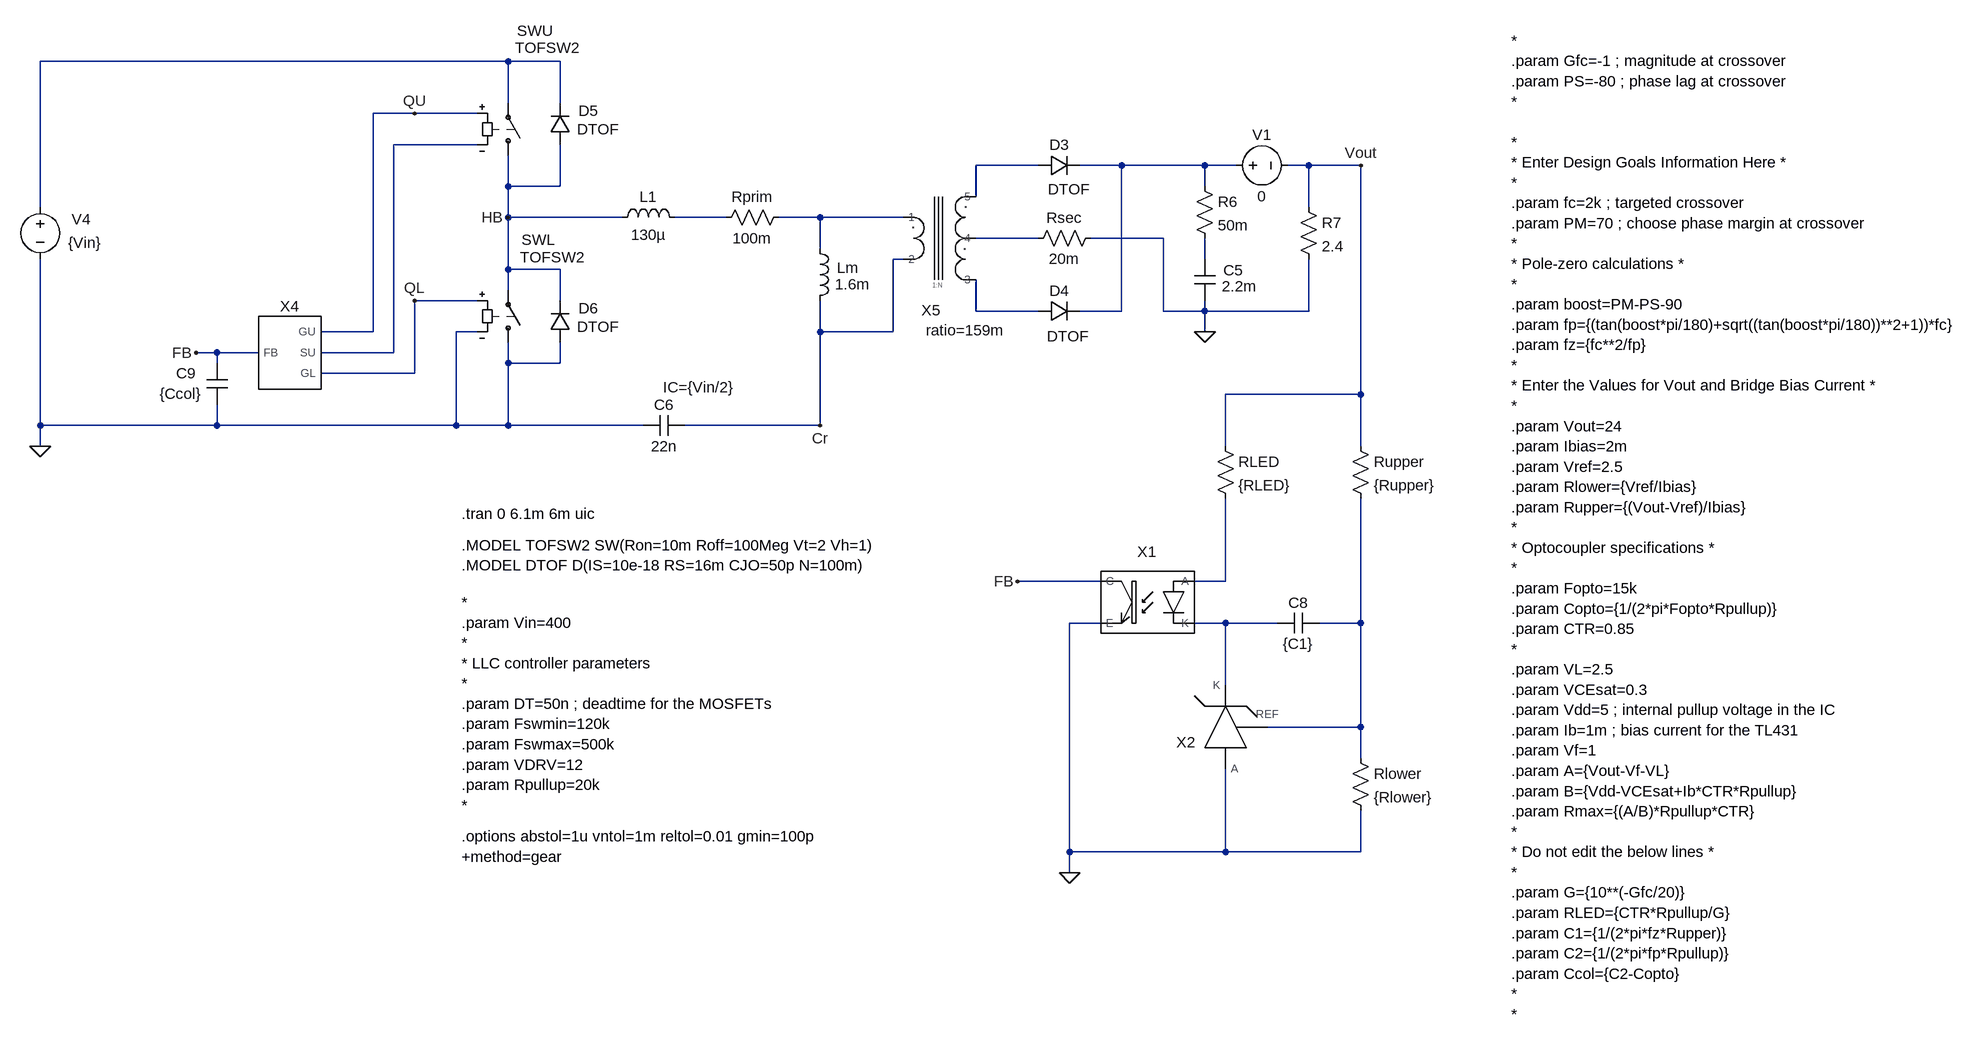
[diagram p0: schematic LLC VM - cbc.asc]
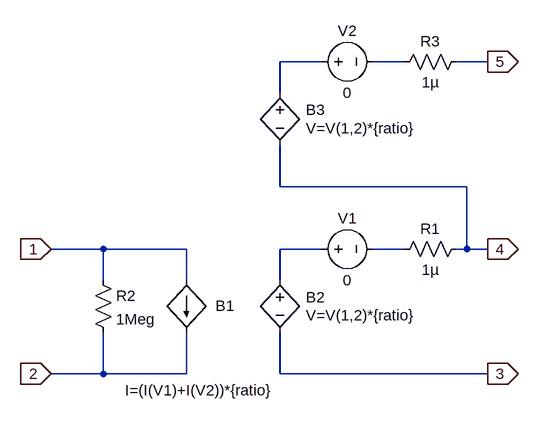
[diagram p1: sub-circuit xfmr_ctap.asc]
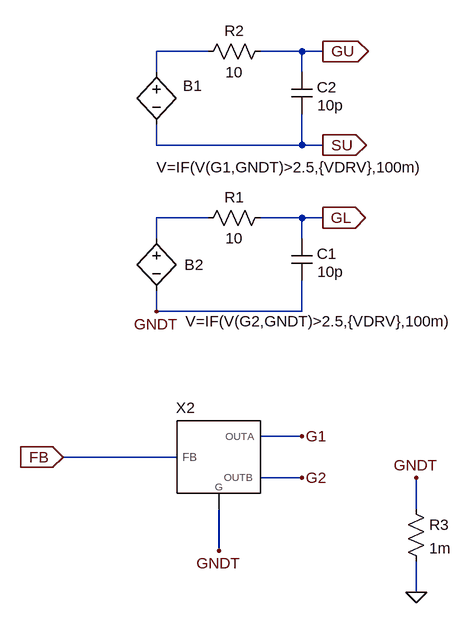
[diagram p2: sub-circuit generic_llc_vm.asc]
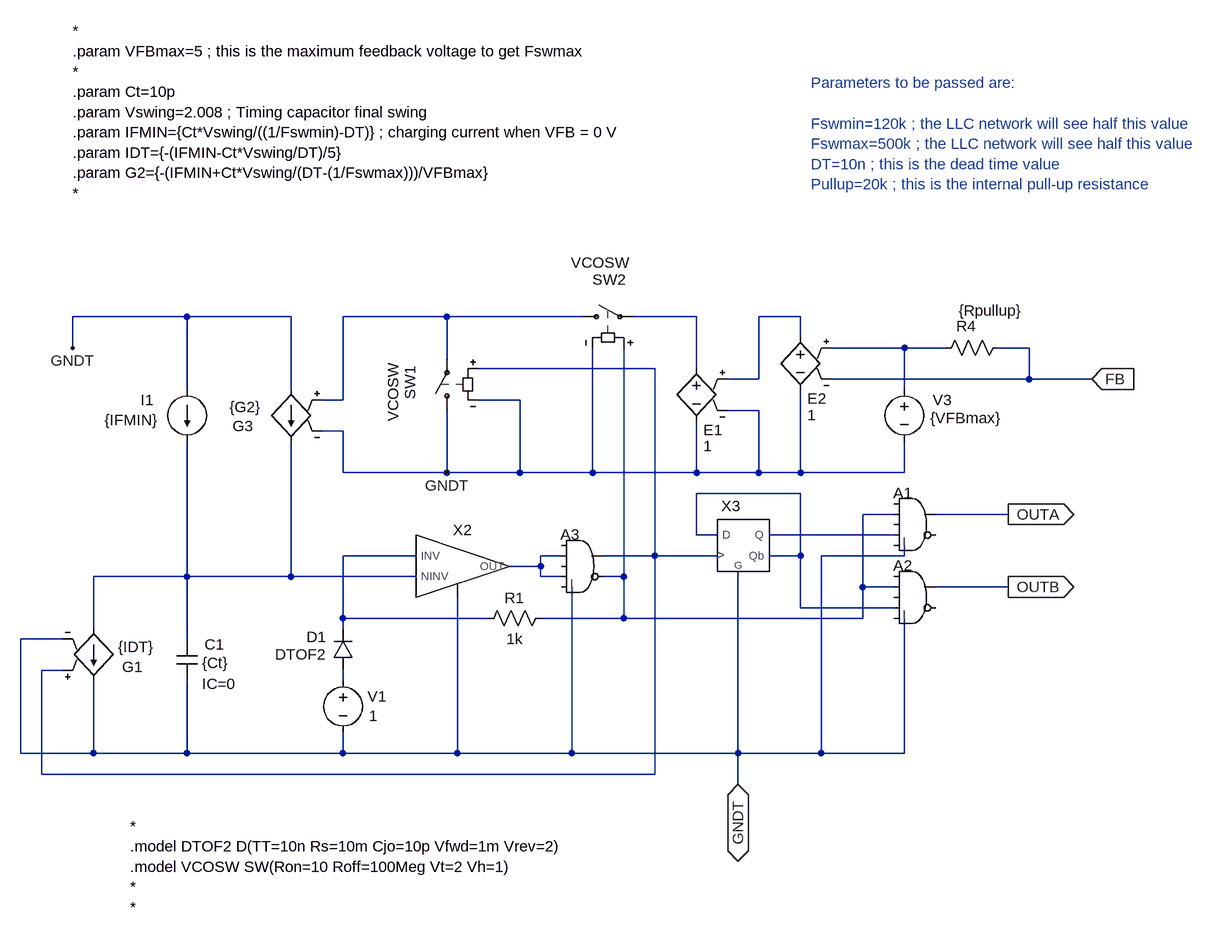
[diagram p3: sub-circuit vco_pulldown_subckt.asc]
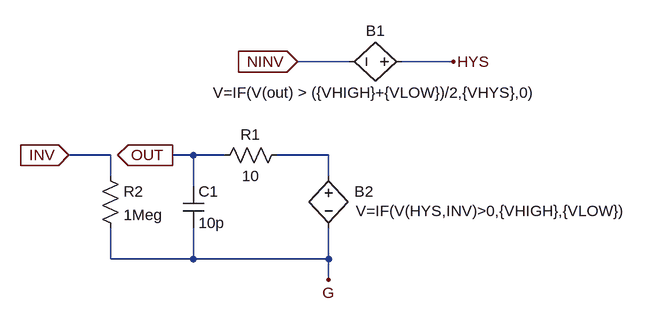
[diagram p4: sub-circuit comptof_g.asc]
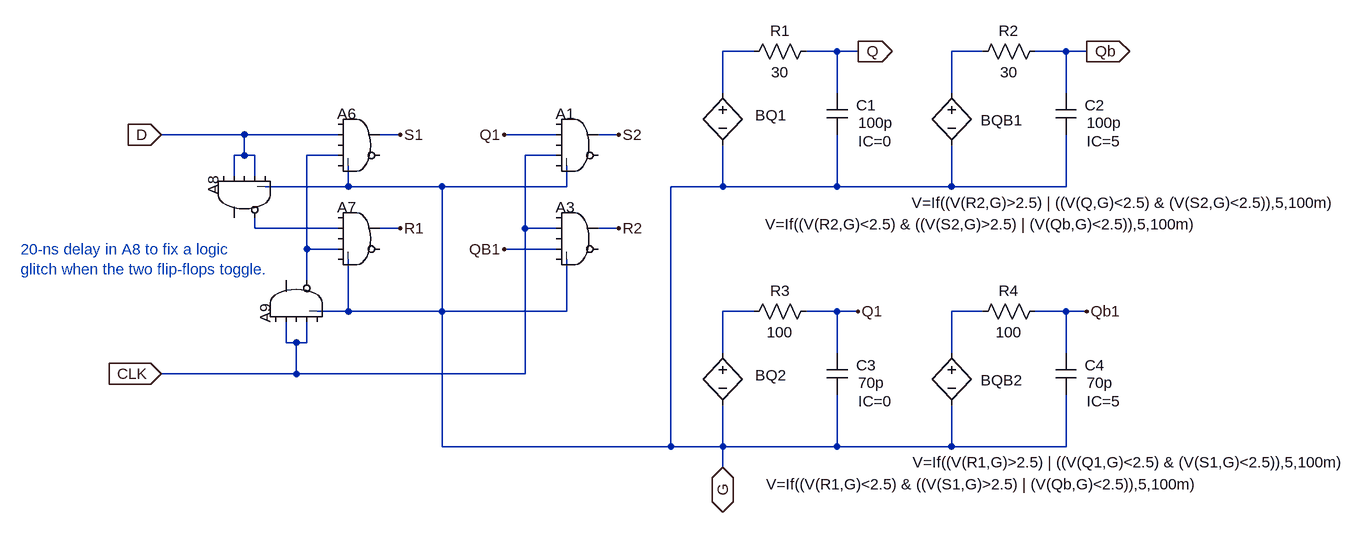
[diagram p5: sub-circuit d_flipflop_g.asc]
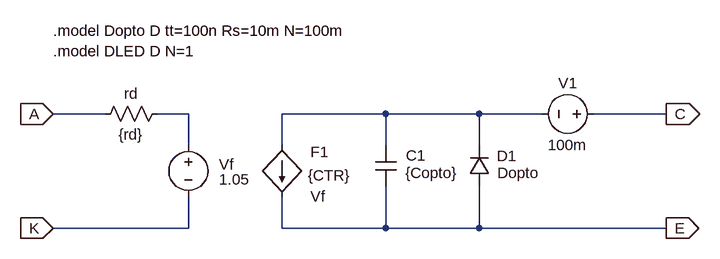
[diagram p6: sub-circuit optotof.asc]
LLC VM - cbc.asc, the LTspice schematic file:
Version 4.1
SHEET 1 3260 680
WIRE -1024 -800 -1744 -800
WIRE -944 -800 -1024 -800
WIRE -1024 -736 -1024 -800
WIRE -944 -736 -944 -800
WIRE -1168 -720 -1232 -720
WIRE -1072 -720 -1168 -720
WIRE -1072 -672 -1200 -672
WIRE -208 -640 -304 -640
WIRE -80 -640 -144 -640
WIRE 48 -640 -80 -640
WIRE 96 -640 48 -640
WIRE 208 -640 176 -640
WIRE 288 -640 208 -640
WIRE -1024 -608 -1024 -656
WIRE -944 -608 -944 -672
WIRE -944 -608 -1024 -608
WIRE 48 -608 48 -640
WIRE -304 -592 -304 -640
WIRE -1744 -576 -1744 -800
WIRE 208 -576 208 -640
WIRE -1024 -560 -1024 -608
WIRE -848 -560 -1024 -560
WIRE -688 -560 -768 -560
WIRE -544 -560 -608 -560
WIRE -416 -560 -544 -560
WIRE -208 -528 -304 -528
WIRE -16 -528 -128 -528
WIRE -544 -512 -544 -560
WIRE -416 -496 -432 -496
WIRE 48 -496 48 -528
WIRE -1024 -480 -1024 -560
WIRE -944 -480 -1024 -480
WIRE -1024 -448 -1024 -480
WIRE -1072 -432 -1168 -432
WIRE -944 -432 -944 -480
WIRE -304 -416 -304 -464
WIRE -208 -416 -304 -416
WIRE -80 -416 -80 -640
WIRE -80 -416 -144 -416
WIRE -16 -416 -16 -528
WIRE 48 -416 48 -432
WIRE 48 -416 -16 -416
WIRE 208 -416 208 -496
WIRE 208 -416 48 -416
WIRE -1232 -384 -1232 -720
WIRE -1232 -384 -1312 -384
WIRE -1072 -384 -1104 -384
WIRE -544 -384 -544 -432
WIRE -432 -384 -432 -496
WIRE -432 -384 -544 -384
WIRE 48 -384 48 -416
WIRE -1472 -352 -1504 -352
WIRE -1408 -352 -1472 -352
WIRE -1200 -352 -1200 -672
WIRE -1200 -352 -1312 -352
WIRE -1472 -336 -1472 -352
WIRE -1024 -336 -1024 -368
WIRE -944 -336 -944 -368
WIRE -944 -336 -1024 -336
WIRE -1168 -320 -1168 -432
WIRE -1168 -320 -1312 -320
WIRE 288 -288 288 -640
WIRE 288 -288 80 -288
WIRE -1744 -240 -1744 -496
WIRE -1472 -240 -1472 -272
WIRE -1472 -240 -1744 -240
WIRE -1104 -240 -1104 -384
WIRE -1104 -240 -1472 -240
WIRE -1024 -240 -1024 -336
WIRE -1024 -240 -1104 -240
WIRE -816 -240 -1024 -240
WIRE -544 -240 -544 -384
WIRE -544 -240 -752 -240
WIRE -1744 -208 -1744 -240
WIRE 80 -208 80 -288
WIRE 288 -208 288 -288
WIRE -112 0 -240 0
WIRE 80 0 80 -128
WIRE 80 0 32 0
WIRE -112 64 -160 64
WIRE 80 64 32 64
WIRE 160 64 80 64
WIRE 288 64 288 -128
WIRE 288 64 224 64
WIRE 80 160 80 64
WIRE 288 224 288 64
WIRE 288 224 144 224
WIRE 288 272 288 224
WIRE -160 416 -160 64
WIRE 80 416 80 288
WIRE 80 416 -160 416
WIRE 288 416 288 352
WIRE 288 416 80 416
WIRE -160 448 -160 416
FLAG -1504 -352 FB
FLAG 48 -384 0
FLAG 288 -640 Vout
FLAG -1024 -560 HB
FLAG -1168 -720 QU
FLAG -1168 -432 QL
FLAG -544 -240 Cr
FLAG -1744 -208 0
FLAG -240 0 FB
FLAG -160 448 0
SYMBOL diode -208 -624 R270
WINDOW 0 32 32 VTop 2
WINDOW 3 -5 48 VBottom 2
SYMATTR InstName D3
SYMATTR Value DTOF
SYMBOL diode -208 -400 R270
WINDOW 0 32 32 VTop 2
WINDOW 3 -7 46 VBottom 2
SYMATTR InstName D4
SYMATTR Value DTOF
SYMBOL res 32 -624 R0
SYMATTR InstName R6
SYMATTR Value 50m
SYMBOL cap 32 -496 R0
WINDOW 0 45 17 Left 2
WINDOW 3 42 42 Left 2
SYMATTR InstName C5
SYMATTR Value 2.2m
SYMBOL res 192 -592 R0
SYMATTR InstName R7
SYMATTR Value 2.4
SYMBOL res -112 -544 R90
WINDOW 0 0 56 VBottom 2
WINDOW 3 32 56 VTop 2
SYMATTR InstName Rsec
SYMATTR Value 20m
SYMBOL ind -560 -528 R0
WINDOW 0 42 45 Left 2
WINDOW 3 39 71 Left 2
SYMATTR InstName Lm
SYMATTR Value 1.6m
SYMBOL cap -752 -256 R90
WINDOW 0 0 32 VBottom 2
WINDOW 3 32 32 VTop 2
WINDOW 123 -27 -21 VBottom 2
SYMATTR InstName C6
SYMATTR Value 22n
SYMATTR Value2 IC={Vin/2}
SYMBOL res -592 -576 R90
WINDOW 0 0 56 VBottom 2
WINDOW 3 32 56 VTop 2
SYMATTR InstName Rprim
SYMATTR Value 100m
SYMBOL ind -864 -544 R270
WINDOW 0 32 56 VTop 2
WINDOW 3 5 56 VBottom 2
SYMATTR InstName L1
SYMATTR Value 130µ
SYMBOL sw -1024 -640 M180
WINDOW 3 11 181 Left 2
WINDOW 0 14 207 Left 2
SYMATTR Value TOFSW2
SYMATTR InstName SWU
SYMBOL sw -1024 -352 M180
WINDOW 3 18 147 Left 2
WINDOW 0 21 174 Left 2
SYMATTR Value TOFSW2
SYMATTR InstName SWL
SYMBOL voltage -1744 -592 R0
WINDOW 0 48 35 Left 2
WINDOW 3 43 71 Left 2
SYMATTR InstName V4
SYMATTR Value {Vin}
SYMBOL diode -928 -672 R180
WINDOW 0 -43 52 Left 2
WINDOW 3 -76 24 Left 2
SYMATTR InstName D5
SYMATTR Value DTOF
SYMBOL diode -928 -368 R180
WINDOW 0 -43 52 Left 2
WINDOW 3 -76 24 Left 2
SYMATTR InstName D6
SYMATTR Value DTOF
SYMBOL XFMR_CTap -352 -544 R0
WINDOW 0 -21 142 Bottom 2
WINDOW 39 32 173 Bottom 2
SYMATTR InstName X5
SYMATTR SpiceLine ratio=159m
SYMBOL res 272 256 R0
SYMATTR InstName Rlower
SYMATTR Value {Rlower}
SYMBOL res 272 -224 R0
SYMATTR InstName Rupper
SYMATTR Value {Rupper}
SYMBOL res 64 -224 R0
SYMATTR InstName RLED
SYMATTR Value {RLED}
SYMBOL cap 224 48 R90
WINDOW 0 0 32 VBottom 2
WINDOW 3 32 32 VTop 2
SYMATTR InstName C8
SYMATTR Value {C1}
SYMBOL cap -1456 -336 M0
WINDOW 0 48 16 Left 2
WINDOW 3 40 47 Left 2
SYMATTR InstName C9
SYMATTR Value {Ccol}
SYMBOL voltage 80 -640 R270
WINDOW 0 32 56 VTop 2
WINDOW 3 -32 56 VBottom 2
SYMATTR InstName V1
SYMATTR Value 0
SYMBOL TOF\\Subcircuits\\Generic_LLC_VM -1360 -352 R0
SYMATTR InstName X4
SYMATTR SpiceLine Fswmin={Fswmin} Fswmax={Fswmax} DT={DT} Rpullup={Rpullup} VDRV={VDRV}
SYMBOL TOF\\Subcircuits\\optoTOF -80 32 M0
SYMATTR InstName X1
SYMATTR SpiceLine rd=100 CTR={CTR} Copto={Copto}
SYMBOL TOF\\Subcircuits\\TL431TOF 64 176 R0
WINDOW 0 -45 87 Bottom 2
SYMATTR InstName X2
TEXT -1096 -104 Left 2 !.tran 0 6.1m 6m uic
TEXT -1096 -56 Left 2 !.MODEL TOFSW2 SW(Ron=10m Roff=100Meg Vt=2 Vh=1)\n.MODEL DTOF D(IS=10e-18 RS=16m CJO=50p N=100m)
TEXT -1096 32 Left 2 !*\n.param Vin=400\n*\n* LLC controller parameters\n*\n.param DT=50n ; deadtime for the MOSFETs\n.param Fswmin=120k\n.param Fswmax=500k\n.param VDRV=12\n.param Rpullup=20k\n*
TEXT -1096 392 Left 2 !.options abstol=1u vntol=1m reltol=0.01 gmin=100p\n+method=gear
TEXT 520 -832 Left 2 !*\n.param Gfc=-1 ; magnitude at crossover\n.param PS=-80 ; phase lag at crossover\n*\n \n*\n* Enter Design Goals Information Here *\n*\n.param fc=2k ; targeted crossover\n.param PM=70 ; choose phase margin at crossover\n*\n* Pole-zero calculations *\n*\n.param boost=PM-PS-90\n.param fp={(tan(boost*pi/180)+sqrt((tan(boost*pi/180))**2+1))*fc}\n.param fz={fc**2/fp}\n*\n* Enter the Values for Vout and Bridge Bias Current *\n*\n.param Vout=24\n.param Ibias=2m\n.param Vref=2.5\n.param Rlower={Vref/Ibias}\n.param Rupper={(Vout-Vref)/Ibias}\n*\n* Optocoupler specifications *\n*\n.param Fopto=15k\n.param Copto={1/(2*pi*Fopto*Rpullup)}\n.param CTR=0.85\n*\n.param VL=2.5\n.param VCEsat=0.3\n.param Vdd=5 ; internal pullup voltage in the IC\n.param Ib=1m ; bias current for the TL431\n.param Vf=1\n.param A={Vout-Vf-VL}\n.param B={Vdd-VCEsat+Ib*CTR*Rpullup}\n.param Rmax={(A/B)*Rpullup*CTR}\n*\n* Do not edit the below lines *\n*\n.param G={10**(-Gfc/20)}\n.param RLED={CTR*Rpullup/G}\n.param C1={1/(2*pi*fz*Rupper)}\n.param C2={1/(2*pi*fp*Rpullup)}\n.param Ccol={C2-Copto}\n*\n*

xfmr_ctap.asc, the sub-circuit schematic file:
Version 4
SHEET 1 880 680
WIRE 368 -192 304 -192
WIRE 496 -192 448 -192
WIRE 624 -192 576 -192
WIRE 304 -144 304 -192
WIRE 304 0 304 -64
WIRE 592 0 304 0
WIRE 32 96 -48 96
WIRE 160 96 32 96
WIRE 368 96 304 96
WIRE 496 96 448 96
WIRE 592 96 592 0
WIRE 592 96 576 96
WIRE 624 96 592 96
WIRE 32 144 32 96
WIRE 160 144 160 96
WIRE 304 144 304 96
WIRE 32 288 32 224
WIRE 32 288 -48 288
WIRE 160 288 160 224
WIRE 160 288 32 288
WIRE 304 288 304 224
WIRE 624 288 304 288
FLAG 624 96 4
IOPIN 624 96 Out
FLAG 624 288 3
IOPIN 624 288 Out
FLAG -48 96 1
IOPIN -48 96 In
FLAG -48 288 2
IOPIN -48 288 In
FLAG 624 -192 5
IOPIN 624 -192 Out
SYMBOL bi 160 144 R0
WINDOW 0 45 39 Left 2
WINDOW 3 -94 169 Left 2
SYMATTR InstName B1
SYMATTR Value I=(I(V1)+I(V2))*{ratio}
SYMBOL bv 304 128 R0
WINDOW 0 40 42 Left 2
WINDOW 3 40 70 Left 2
SYMATTR InstName B2
SYMATTR Value V=V(1,2)*{ratio}
SYMBOL voltage 352 96 R270
WINDOW 0 32 56 VTop 2
WINDOW 3 -32 56 VBottom 2
WINDOW 123 0 0 Left 0
WINDOW 39 0 0 Left 0
SYMATTR InstName V1
SYMATTR Value 0
SYMBOL res 592 80 R90
WINDOW 0 0 56 VBottom 2
WINDOW 3 32 56 VTop 2
SYMATTR InstName R1
SYMATTR Value 1µ
SYMBOL res 16 128 R0
SYMATTR InstName R2
SYMATTR Value 1Meg
SYMBOL bv 304 -160 R0
WINDOW 0 40 42 Left 2
WINDOW 3 40 70 Left 2
SYMATTR InstName B3
SYMATTR Value V=V(1,2)*{ratio}
SYMBOL voltage 352 -192 R270
WINDOW 0 32 56 VTop 2
WINDOW 3 -32 56 VBottom 2
WINDOW 123 0 0 Left 0
WINDOW 39 0 0 Left 0
SYMATTR InstName V2
SYMATTR Value 0
SYMBOL res 592 -208 R90
WINDOW 0 0 56 VBottom 2
WINDOW 3 32 56 VTop 2
SYMATTR InstName R3
SYMATTR Value 1µ

generic_llc_vm.asc, the sub-circuit schematic file:
Version 4.1
SHEET 1 880 680
WIRE 112 -448 32 -448
WIRE 256 -448 192 -448
WIRE 288 -448 256 -448
WIRE 32 -416 32 -448
WIRE 256 -416 256 -448
WIRE 32 -304 32 -336
WIRE 256 -304 256 -352
WIRE 256 -304 32 -304
WIRE 288 -304 256 -304
WIRE 112 -192 32 -192
WIRE 256 -192 192 -192
WIRE 288 -192 256 -192
WIRE 32 -160 32 -192
WIRE 256 -160 256 -192
WIRE 32 -48 32 -80
WIRE 256 -48 256 -96
WIRE 256 -48 32 -48
WIRE 256 144 192 144
WIRE 64 176 -112 176
WIRE 256 208 192 208
WIRE 432 256 432 208
WIRE 128 320 128 256
WIRE 432 384 432 336
FLAG -112 176 FB
IOPIN -112 176 In
FLAG 128 320 GNDT
FLAG 32 -48 GNDT
FLAG 288 -192 GL
IOPIN 288 -192 Out
FLAG 288 -448 GU
IOPIN 288 -448 Out
FLAG 288 -304 SU
IOPIN 288 -304 Out
FLAG 256 144 G1
FLAG 256 208 G2
FLAG 432 384 0
FLAG 432 208 GNDT
SYMBOL bv 32 -432 R0
WINDOW 0 41 37 Left 2
WINDOW 3 0 162 Left 2
SYMATTR InstName B1
SYMATTR Value V=IF(V(G1,GNDT)>2.5,{VDRV},100m)
SYMBOL bv 32 -176 R0
WINDOW 0 43 56 Left 2
WINDOW 3 45 143 Left 2
SYMATTR InstName B2
SYMATTR Value V=IF(V(G2,GNDT)>2.5,{VDRV},100m)
SYMBOL res 208 -208 R90
WINDOW 0 0 56 VBottom 2
WINDOW 3 32 56 VTop 2
SYMATTR InstName R1
SYMATTR Value 10
SYMBOL cap 240 -160 R0
WINDOW 0 39 23 Left 2
WINDOW 3 40 51 Left 2
SYMATTR InstName C1
SYMATTR Value 10p
SYMBOL res 208 -464 R90
WINDOW 0 0 56 VBottom 2
WINDOW 3 32 56 VTop 2
SYMATTR InstName R2
SYMATTR Value 10
SYMBOL cap 240 -416 R0
WINDOW 0 39 23 Left 2
WINDOW 3 40 51 Left 2
SYMATTR InstName C2
SYMATTR Value 10p
SYMBOL res 416 240 R0
SYMATTR InstName R3
SYMATTR Value 1m
SYMBOL TOF\\Subcircuits\\VCO_pulldown_subckt 128 176 R0
WINDOW 0 -51 -60 Bottom 2
SYMATTR InstName X2
SYMATTR SpiceLine Fswmin={Fswmin} Fswmax={Fswmax} Rpullup={Rpullup} DT={DT}

vco_pulldown_subckt.asc, the sub-circuit schematic file:
Version 4.1
SHEET 1 1284 752
WIRE -656 -160 -832 -160
WIRE -496 -160 -656 -160
WIRE -256 -160 -416 -160
WIRE -48 -160 -256 -160
WIRE 128 -160 32 -160
WIRE 288 -160 224 -160
WIRE 288 -128 288 -160
WIRE -832 -112 -832 -160
WIRE 448 -112 336 -112
WIRE 512 -112 448 -112
WIRE 640 -112 592 -112
WIRE -256 -96 -256 -160
WIRE 64 -80 -208 -80
WIRE 128 -80 128 -160
WIRE 224 -64 224 -160
WIRE 224 -64 176 -64
WIRE 640 -64 640 -112
WIRE 640 -64 336 -64
WIRE 736 -64 640 -64
WIRE -656 -48 -656 -160
WIRE -496 -48 -496 -160
WIRE 448 -48 448 -112
WIRE -416 -32 -416 -160
WIRE -416 -32 -448 -32
WIRE -144 -32 -208 -32
WIRE 224 -16 176 -16
WIRE -416 16 -448 16
WIRE -416 80 -416 16
WIRE -256 80 -256 -16
WIRE -256 80 -416 80
WIRE -144 80 -144 -32
WIRE -144 80 -256 80
WIRE -32 80 -32 -112
WIRE -32 80 -144 80
WIRE 128 80 128 0
WIRE 128 80 -32 80
WIRE 224 80 224 -16
WIRE 224 80 128 80
WIRE 288 80 288 -48
WIRE 288 80 224 80
WIRE 448 80 448 32
WIRE 448 80 288 80
WIRE 288 112 128 112
WIRE 432 144 384 144
WIRE 608 144 496 144
WIRE 128 176 128 112
WIRE 160 176 128 176
WIRE 432 176 240 176
WIRE -304 208 -416 208
WIRE -80 208 -112 208
WIRE 64 208 64 -80
WIRE 64 208 -16 208
WIRE 160 208 64 208
WIRE 288 208 288 112
WIRE 288 208 240 208
WIRE 448 208 448 192
WIRE 448 208 320 208
WIRE -112 224 -112 208
WIRE -112 224 -160 224
WIRE -656 240 -656 32
WIRE -656 240 -800 240
WIRE -496 240 -496 32
WIRE -496 240 -656 240
WIRE -304 240 -496 240
WIRE -112 240 -112 224
WIRE -80 240 -112 240
WIRE 16 240 16 -112
WIRE 16 240 -16 240
WIRE 384 256 384 144
WIRE 432 256 384 256
WIRE 608 256 496 256
WIRE 288 288 288 208
WIRE 432 288 288 288
WIRE -416 304 -416 208
WIRE -192 304 -416 304
WIRE 16 304 16 240
WIRE 16 304 -112 304
WIRE 384 304 384 256
WIRE 384 304 16 304
WIRE -800 320 -800 240
WIRE -416 320 -416 304
WIRE -848 336 -912 336
WIRE -656 336 -656 240
WIRE -848 384 -880 384
WIRE -416 400 -416 384
WIRE -912 512 -912 336
WIRE -800 512 -800 400
WIRE -800 512 -912 512
WIRE -656 512 -656 400
WIRE -656 512 -800 512
WIRE -416 512 -416 480
WIRE -416 512 -656 512
WIRE -240 512 -240 272
WIRE -240 512 -416 512
WIRE -64 512 -64 256
WIRE -64 512 -240 512
WIRE 192 512 192 240
WIRE 192 512 -64 512
WIRE 320 512 320 208
WIRE 320 512 192 512
WIRE 448 512 448 304
WIRE 448 512 320 512
WIRE -880 544 -880 384
WIRE 64 544 64 208
WIRE 64 544 -880 544
WIRE 192 560 192 512
FLAG 608 144 OUTA
IOPIN 608 144 Out
FLAG 608 256 OUTB
IOPIN 608 256 Out
FLAG 192 560 GNDT
IOPIN 192 560 BiDir
FLAG -832 -112 GNDT
FLAG -256 80 GNDT
FLAG 736 -64 FB
IOPIN 736 -64 In
SYMBOL Digital\\and 464 96 R0
WINDOW 0 -33 15 Left 2
SYMATTR InstName A1
SYMATTR SpiceLine Vhigh=5 Vlow=0 Ref=2.5
SYMBOL Digital\\and 464 208 R0
WINDOW 0 -33 15 Left 2
SYMATTR InstName A2
SYMATTR SpiceLine Vhigh=5 Vlow=0 Ref=2.5
SYMBOL Digital\\and -48 160 R0
WINDOW 0 -33 15 Left 2
SYMATTR InstName A3
SYMATTR SpiceLine Vhigh=5 Vlow=0 Ref=2.5
SYMBOL voltage -416 384 R0
WINDOW 0 38 40 Left 2
WINDOW 3 40 70 Left 2
SYMATTR InstName V1
SYMATTR Value 1
SYMBOL diode -400 384 R180
WINDOW 0 41 51 Left 2
WINDOW 3 41 24 Left 2
SYMATTR InstName D1
SYMATTR Value DTOF2
SYMBOL res -96 288 R90
WINDOW 0 0 56 VBottom 2
WINDOW 3 32 56 VTop 2
SYMATTR InstName R1
SYMATTR Value 1k
SYMBOL g -800 416 M180
WINDOW 0 44 37 Left 2
WINDOW 3 38 68 Left 2
SYMATTR InstName G1
SYMATTR Value {IDT}
SYMBOL cap -672 336 R0
WINDOW 0 43 8 Left 2
WINDOW 3 39 37 Left 2
WINDOW 39 39 69 Left 2
SYMATTR InstName C1
SYMATTR Value {Ct}
SYMATTR SpiceLine IC=0
SYMBOL current -656 -48 M0
WINDOW 0 51 16 Left 2
WINDOW 3 44 47 Left 2
SYMATTR InstName I1
SYMATTR Value {IFMIN}
SYMBOL sw -256 0 R180
WINDOW 3 83 89 VLeft 2
WINDOW 0 57 84 VLeft 2
SYMATTR Value VCOSW
SYMATTR InstName SW1
SYMBOL g2 -496 48 R180
WINDOW 0 58 40 Left 2
WINDOW 3 46 69 Left 2
SYMATTR InstName G3
SYMATTR Value {G2}
SYMBOL sw -64 -160 R270
WINDOW 3 83 89 VLeft 2
WINDOW 0 57 84 VLeft 2
SYMATTR Value VCOSW
SYMATTR InstName SW2
SYMBOL e 128 -96 M0
WINDOW 0 -40 110 Left 2
WINDOW 3 -24 135 Left 2
SYMATTR InstName E1
SYMATTR Value 1
SYMBOL e 288 -144 M0
WINDOW 0 -40 110 Left 2
WINDOW 3 -24 135 Left 2
SYMATTR InstName E2
SYMATTR Value 1
SYMBOL voltage 448 -64 R0
WINDOW 0 44 32 Left 2
WINDOW 3 40 60 Left 2
SYMATTR InstName V3
SYMATTR Value {VFBmax}
SYMBOL res 608 -128 R90
WINDOW 0 -2 65 VBottom 2
WINDOW 3 -57 27 VTop 2
SYMATTR InstName R4
SYMATTR Value {Rpullup}
SYMBOL TOF\\Subcircuits\\COMPTOF_G -240 224 R0
SYMATTR InstName X2
SYMATTR SpiceLine VHIGH=5 VLOW=1m VHYS=1u
SYMBOL TOF\\Subcircuits\\D_FlipFlop_G 192 192 R0
WINDOW 0 -11 -45 Bottom 2
SYMATTR InstName X3
TEXT -744 624 Left 2 !*\n.model DTOF2 D(TT=10n Rs=10m Cjo=10p Vfwd=1m Vrev=2)\n.model VCOSW SW(Ron=10 Roff=100Meg Vt=2 Vh=1)\n*\n*
TEXT -832 -600 Left 2 !*\n.param VFBmax=5 ; this is the maximum feedback voltage to get Fswmax\n*\n.param Ct=10p\n.param Vswing=2.008 ; Timing capacitor final swing\n.param IFMIN={Ct*Vswing/((1/Fswmin)-DT)} ; charging current when VFB = 0 V\n.param IDT={-(IFMIN-Ct*Vswing/DT)/5}\n.param G2={-(IFMIN+Ct*Vswing/(DT-(1/Fswmax)))/VFBmax}\n*
TEXT 304 -520 Left 2 ;Parameters to be passed are:\n \nFswmin=120k ; the LLC network will see half this value\nFswmax=500k ; the LLC network will see half this value\nDT=10n ; this is the dead time value\nPullup=20k ; this is the internal pull-up resistance

comptof_g.asc, the sub-circuit schematic file:
Version 4.1
SHEET 1 880 680
WIRE 64 192 -16 192
WIRE 224 192 144 192
WIRE -304 336 -368 336
WIRE -176 336 -208 336
WIRE -128 336 -176 336
WIRE 32 336 -48 336
WIRE -304 368 -304 336
WIRE 32 368 32 336
WIRE -176 384 -176 336
WIRE -304 496 -304 448
WIRE -176 496 -176 448
WIRE -176 496 -304 496
WIRE 32 496 32 448
WIRE 32 496 -176 496
WIRE 32 528 32 496
FLAG -16 192 NINV
IOPIN -16 192 In
FLAG 224 192 HYS
FLAG -208 336 OUT
IOPIN -208 336 Out
FLAG -368 336 INV
IOPIN -368 336 In
FLAG 32 528 G
SYMBOL bv 160 192 R90
WINDOW 0 -32 56 VBottom 2
WINDOW 3 32 56 VTop 2
SYMATTR InstName B1
SYMATTR Value V=IF(V(out) > ({VHIGH}+{VLOW})/2,{VHYS},0)
SYMBOL bv 32 352 R0
WINDOW 0 40 40 Left 2
WINDOW 3 42 70 Left 2
SYMATTR InstName B2
SYMATTR Value V=IF(V(HYS,INV)>0,{VHIGH},{VLOW})
SYMBOL res -32 320 R90
WINDOW 0 0 56 VBottom 2
WINDOW 3 32 56 VTop 2
SYMATTR InstName R1
SYMATTR Value 10
SYMBOL cap -192 384 R0
SYMATTR InstName C1
SYMATTR Value 10p
SYMBOL res -320 352 R0
SYMATTR InstName R2
SYMATTR Value 1Meg

d_flipflop_g.asc, the sub-circuit schematic file:
Version 4.1
SHEET 1 1820 1368
WIRE 768 448 720 448
WIRE 896 448 848 448
WIRE 928 448 896 448
WIRE 1120 448 1072 448
WIRE 1248 448 1200 448
WIRE 1280 448 1248 448
WIRE 720 512 720 448
WIRE 896 512 896 448
WIRE 1072 512 1072 448
WIRE 1248 512 1248 448
WIRE -16 576 -144 576
WIRE 128 576 -16 576
WIRE 224 576 192 576
WIRE 464 576 384 576
WIRE 560 576 528 576
WIRE -16 608 -16 576
WIRE -16 608 -32 608
WIRE 0 608 -16 608
WIRE 128 608 80 608
WIRE 464 608 416 608
WIRE -32 640 -32 608
WIRE 0 640 0 608
WIRE 144 656 144 624
WIRE 144 656 16 656
WIRE 288 656 144 656
WIRE 480 656 480 624
WIRE 480 656 288 656
WIRE 720 656 720 592
WIRE 720 656 640 656
WIRE 896 656 896 576
WIRE 896 656 720 656
WIRE 1072 656 1072 592
WIRE 1072 656 896 656
WIRE 1248 656 1248 576
WIRE 1248 656 1072 656
WIRE 0 720 0 704
WIRE 128 720 0 720
WIRE 224 720 192 720
WIRE 416 720 416 608
WIRE 464 720 416 720
WIRE 560 720 528 720
WIRE 80 752 80 608
WIRE 128 752 80 752
WIRE 464 752 384 752
WIRE 80 800 80 752
WIRE 144 848 144 768
WIRE 144 848 96 848
WIRE 288 848 288 656
WIRE 288 848 144 848
WIRE 480 848 480 768
WIRE 480 848 288 848
WIRE 768 848 720 848
WIRE 896 848 848 848
WIRE 928 848 896 848
WIRE 1120 848 1072 848
WIRE 1248 848 1200 848
WIRE 1280 848 1248 848
WIRE 48 896 48 864
WIRE 64 896 48 896
WIRE 80 896 80 864
WIRE 80 896 64 896
WIRE 720 912 720 848
WIRE 896 912 896 848
WIRE 1072 912 1072 848
WIRE 1248 912 1248 848
WIRE 64 944 64 896
WIRE 64 944 -144 944
WIRE 416 944 416 720
WIRE 416 944 64 944
WIRE 288 1056 288 848
WIRE 640 1056 640 656
WIRE 640 1056 288 1056
WIRE 720 1056 720 992
WIRE 720 1056 640 1056
WIRE 896 1056 896 976
WIRE 896 1056 720 1056
WIRE 1072 1056 1072 992
WIRE 1072 1056 896 1056
WIRE 1248 1056 1248 976
WIRE 1248 1056 1072 1056
WIRE 720 1088 720 1056
FLAG -144 576 D
IOPIN -144 576 In
FLAG -144 944 CLK
IOPIN -144 944 In
FLAG 560 576 S2
FLAG 560 720 R2
FLAG 928 448 Q
IOPIN 928 448 Out
FLAG 1280 448 Qb
IOPIN 1280 448 Out
FLAG 224 576 S1
FLAG 224 720 R1
FLAG 384 576 Q1
FLAG 384 752 QB1
FLAG 928 848 Q1
FLAG 1280 848 Qb1
FLAG 720 1088 G
IOPIN 720 1088 BiDir
SYMBOL Digital\\and 496 528 R0
WINDOW 0 -33 16 Left 2
SYMATTR InstName A1
SYMATTR SpiceLine Vhigh=5 Vlow=100m Ref=2.5
SYMBOL Digital\\and 496 672 R0
WINDOW 0 -33 16 Left 2
SYMATTR InstName A3
SYMATTR SpiceLine Vhigh=5 Vlow=100m Ref=2.5
SYMBOL Digital\\and 160 528 R0
WINDOW 0 -33 16 Left 2
SYMATTR InstName A6
SYMATTR SpiceLine Vhigh=5 Vlow=100m Ref=2.5
SYMBOL Digital\\and 160 672 R0
WINDOW 0 -33 16 Left 2
SYMATTR InstName A7
SYMATTR SpiceLine Vhigh=5 Vlow=100m Ref=2.5
SYMBOL Digital\\and -80 672 M90
WINDOW 0 -33 16 Left 2
SYMATTR InstName A8
SYMATTR SpiceLine Vhigh=5 Vlow=100m Ref=2.5 Td=20n
SYMBOL Digital\\and 0 832 R270
WINDOW 0 -33 16 Left 2
SYMATTR InstName A9
SYMATTR SpiceLine Vhigh=5 Vlow=100m Ref=2.5
SYMBOL bv 720 496 R0
WINDOW 0 50 50 Left 2
WINDOW 3 65 218 Left 2
SYMATTR InstName BQ1
SYMATTR Value V=If((V(R2,G)<2.5) & ((V(S2,G)>2.5) | (V(Qb,G)<2.5)),5,100m)
SYMBOL res 864 432 R90
WINDOW 0 0 56 VBottom 2
WINDOW 3 32 56 VTop 2
SYMATTR InstName R1
SYMATTR Value 30
SYMBOL cap 880 512 R0
WINDOW 0 45 19 Left 2
WINDOW 3 48 46 Left 2
WINDOW 123 48 74 Left 2
SYMATTR InstName C1
SYMATTR Value 100p
SYMATTR Value2 IC=0
SYMBOL bv 1072 496 R0
WINDOW 0 45 58 Left 2
WINDOW 3 -61 185 Left 2
SYMATTR InstName BQB1
SYMATTR Value V=If((V(R2,G)>2.5) | ((V(Q,G)<2.5) & (V(S2,G)<2.5)),5,100m)
SYMBOL res 1216 432 R90
WINDOW 0 0 56 VBottom 2
WINDOW 3 32 56 VTop 2
SYMATTR InstName R2
SYMATTR Value 30
SYMBOL cap 1232 512 R0
WINDOW 0 45 19 Left 2
WINDOW 3 48 46 Left 2
WINDOW 123 48 74 Left 2
SYMATTR InstName C2
SYMATTR Value 100p
SYMATTR Value2 IC=5
SYMBOL bv 720 896 R0
WINDOW 0 50 50 Left 2
WINDOW 3 67 218 Left 2
SYMATTR InstName BQ2
SYMATTR Value V=If((V(R1,G)<2.5) & ((V(S1,G)>2.5) | (V(Qb,G)<2.5)),5,100m)
SYMBOL res 864 832 R90
WINDOW 0 0 56 VBottom 2
WINDOW 3 32 56 VTop 2
SYMATTR InstName R3
SYMATTR Value 100
SYMBOL cap 880 912 R0
WINDOW 0 45 19 Left 2
WINDOW 3 48 46 Left 2
WINDOW 123 48 74 Left 2
SYMATTR InstName C3
SYMATTR Value 70p
SYMATTR Value2 IC=0
SYMBOL bv 1072 896 R0
WINDOW 0 45 58 Left 2
WINDOW 3 -60 184 Left 2
SYMATTR InstName BQB2
SYMATTR Value V=If((V(R1,G)>2.5) | ((V(Q1,G)<2.5) & (V(S1,G)<2.5)),5,100m)
SYMBOL res 1216 832 R90
WINDOW 0 0 56 VBottom 2
WINDOW 3 32 56 VTop 2
SYMATTR InstName R4
SYMATTR Value 100
SYMBOL cap 1232 912 R0
WINDOW 0 45 19 Left 2
WINDOW 3 48 46 Left 2
WINDOW 123 48 74 Left 2
SYMATTR InstName C4
SYMATTR Value 70p
SYMATTR Value2 IC=5
TEXT -360 752 Left 2 ;20-ns delay in A8 to fix a logic \nglitch when the two flip-flops toggle.

optotof.asc, the sub-circuit schematic file:
Version 4
SHEET 1 892 680
WIRE -48 32 -128 32
WIRE 80 32 32 32
WIRE 384 32 224 32
WIRE 528 32 384 32
WIRE 624 32 528 32
WIRE 816 32 704 32
WIRE 80 80 80 32
WIRE 224 80 224 32
WIRE 384 80 384 32
WIRE 528 80 528 32
WIRE 80 208 80 160
WIRE 80 208 -128 208
WIRE 224 208 224 160
WIRE 384 208 384 144
WIRE 384 208 224 208
WIRE 528 208 528 144
WIRE 528 208 384 208
WIRE 816 208 528 208
FLAG -128 32 A
IOPIN -128 32 In
FLAG -128 208 K
IOPIN -128 208 In
FLAG 816 32 C
IOPIN 816 32 Out
FLAG 816 208 E
IOPIN 816 208 Out
SYMBOL f 224 80 R0
WINDOW 0 44 11 Left 2
WINDOW 3 40 47 Left 2
WINDOW 38 44 79 Left 2
SYMATTR InstName F1
SYMATTR Value {CTR}
SYMATTR SpiceModel Vf
SYMBOL res 48 16 R90
WINDOW 0 0 56 VBottom 2
WINDOW 3 32 56 VTop 2
SYMATTR InstName rd
SYMATTR Value {rd}
SYMBOL voltage 80 64 R0
WINDOW 0 47 46 Left 2
WINDOW 3 47 69 Left 2
WINDOW 123 0 0 Left 0
WINDOW 39 0 0 Left 0
SYMATTR InstName Vf
SYMATTR Value 1.05
SYMBOL voltage 720 32 R90
WINDOW 0 -32 56 VBottom 2
WINDOW 3 32 56 VTop 2
SYMATTR InstName V1
SYMATTR Value 100m
SYMBOL cap 368 80 R0
WINDOW 0 47 16 Left 2
WINDOW 3 46 43 Left 2
SYMATTR InstName C1
SYMATTR Value {Copto}
SYMBOL diode 512 144 M180
WINDOW 0 43 47 Left 2
WINDOW 3 44 21 Left 2
SYMATTR InstName D1
SYMATTR Value Dopto
TEXT -128 -96 Left 2 !.model Dopto D tt=100n Rs=10m N=100m\n.model DLED D N=1

The netlist it stands for:
* LLC VM - cbc.asc
D3 N003 N004 DTOF
D4 N009 N004 DTOF
R6 N004 N008 50m
C5 N008 0 2.2m
R7 Vout 0 2.4
Rsec 0 N007 20m
Lm N006 Cr 1.6m
C6 Cr 0 22n IC={Vin/2}
Rprim N006 N005 100m
L1 HB N005 130µ
SWU HB N001 QU N002 TOFSW2
SWL 0 HB QL 0 TOFSW2
V4 N001 0 {Vin}
D5 HB N001 DTOF
D6 0 HB DTOF
X§X5 N006 Cr N009 N007 N003 xfmr_ctap params: ratio=159m
Rlower N012 0 {Rlower}
Rupper Vout N012 {Rupper}
RLED Vout N010 {RLED}
C8 N012 N011 {C1}
C9 FB 0 {Ccol}
V1 N004 Vout 0
X§X4 FB QL QU N002 generic_llc_vm params: Fswmin={Fswmin} Fswmax={Fswmax} DT={DT} Rpullup={Rpullup} VDRV={VDRV}
X§X1 N010 N011 FB 0 optotof params: rd=100 CTR={CTR} Copto={Copto}
X§X2 0 N012 N011 TL431TOF  ; pins A REF K

* block symbol definitions
.subckt xfmr_ctap 1 2 3 4 5
B1 1 2 I=(I(V1)+I(V2))*{ratio}
B2 N003 3 V=V(1,2)*{ratio}
V1 N003 N004 0
R1 4 N004 1µ
R2 1 2 1Meg
B3 N001 4 V=V(1,2)*{ratio}
V2 N001 N002 0
R3 5 N002 1µ
.ends xfmr_ctap

.subckt generic_llc_vm FB GL GU SU
B1 N001 SU V=IF(V(G1,GNDT)>2.5,{VDRV},100m)
B2 N002 GNDT V=IF(V(G2,GNDT)>2.5,{VDRV},100m)
R1 GL N002 10
C1 GL GNDT 10p
R2 GU N001 10
C2 GU SU 10p
R3 GNDT 0 1m
X§X2 FB GNDT G1 G2 vco_pulldown_subckt params: Fswmin={Fswmin} Fswmax={Fswmax} Rpullup={Rpullup} DT={DT}
.ends generic_llc_vm

.subckt vco_pulldown_subckt FB GNDT OUTA OUTB
A1 GNDT N007 GNDT N008 GNDT GNDT OUTA GNDT AND Vhigh=5 Vlow=0 Ref=2.5
A2 GNDT N007 GNDT N006 GNDT GNDT OUTB GNDT AND Vhigh=5 Vlow=0 Ref=2.5
A3 GNDT N010 GNDT N010 GNDT N007 N005 GNDT AND Vhigh=5 Vlow=0 Ref=2.5
V1 N012 GNDT 1
D1 N012 N009 DTOF2
R1 N007 N009 1k
G1 N011 GNDT N005 GNDT {IDT}
C1 N011 GNDT {Ct} IC=0
I1 GNDT N011 {IFMIN}
SW1 GNDT N001 N005 GNDT VCOSW
G3 GNDT N011 N001 GNDT {G2}
SW2 N001 N002 N007 GNDT VCOSW
E1 N002 GNDT N003 GNDT 1
E2 N003 GNDT N004 FB 1
V3 N004 GNDT {VFBmax}
R4 FB N004 {Rpullup}
X§X2 N009 N011 N010 GNDT comptof_g params: VHIGH=5 VLOW=1m VHYS=1u
X§X3 N006 N005 N008 N006 GNDT d_flipflop_g
*
.model DTOF2 D(TT=10n Rs=10m Cjo=10p Vfwd=1m Vrev=2)
.model VCOSW SW(Ron=10 Roff=100Meg Vt=2 Vh=1)
*
*
*
.param VFBmax=5 ; this is the maximum feedback voltage to get Fswmax
*
.param Ct=10p
.param Vswing=2.008 ; Timing capacitor final swing
.param IFMIN={Ct*Vswing/((1/Fswmin)-DT)} ; charging current when VFB = 0 V
.param IDT={-(IFMIN-Ct*Vswing/DT)/5}
.param G2={-(IFMIN+Ct*Vswing/(DT-(1/Fswmax)))/VFBmax}
*
* Parameters to be passed are:
* Fswmin=120k ; the LLC network will see half this value
* Fswmax=500k ; the LLC network will see half this value
* DT=10n ; this is the dead time value
* Pullup=20k ; this is the internal pull-up resistance
.ends vco_pulldown_subckt

.subckt comptof_g INV NINV OUT G
B1 HYS NINV V=IF(V(out) > ({VHIGH}+{VLOW})/2,{VHYS},0)
B2 N001 G V=IF(V(HYS,INV)>0,{VHIGH},{VLOW})
R1 N001 OUT 10
C1 OUT G 10p
R2 INV G 1Meg
.ends comptof_g

.subckt d_flipflop_g D CLK Q Qb G
A1 G Q1 G CLK G G S2 G AND Vhigh=5 Vlow=100m Ref=2.5
A3 G CLK G QB1 G G R2 G AND Vhigh=5 Vlow=100m Ref=2.5
A6 G D G N003 G G S1 G AND Vhigh=5 Vlow=100m Ref=2.5
A7 G N004 G N003 G G R1 G AND Vhigh=5 Vlow=100m Ref=2.5
A8 G D G D G N004 G G AND Vhigh=5 Vlow=100m Ref=2.5 Td=20n
A9 G CLK G CLK G N003 G G AND Vhigh=5 Vlow=100m Ref=2.5
BQ1 N001 G V=If((V(R2,G)<2.5) & ((V(S2,G)>2.5) | (V(Qb,G)<2.5)),5,100m)
R1 Q N001 30
C1 Q G 100p IC=0
BQB1 N002 G V=If((V(R2,G)>2.5) | ((V(Q,G)<2.5) & (V(S2,G)<2.5)),5,100m)
R2 Qb N002 30
C2 Qb G 100p IC=5
BQ2 N005 G V=If((V(R1,G)<2.5) & ((V(S1,G)>2.5) | (V(Qb,G)<2.5)),5,100m)
R3 Q1 N005 100
C3 Q1 G 70p IC=0
BQB2 N006 G V=If((V(R1,G)>2.5) | ((V(Q1,G)<2.5) & (V(S1,G)<2.5)),5,100m)
R4 QB1 N006 100
C4 QB1 G 70p IC=5
* 20-ns delay in A8 to fix a logic
* glitch when the two flip-flops toggle.
.ends d_flipflop_g

.subckt optotof A K C E
F1 N002 E Vf {CTR}
rd N001 A {rd}
Vf N001 K 1.05
V1 C N002 100m
C1 N002 E {Copto}
D1 E N002 Dopto
.model Dopto D tt=100n Rs=10m N=100m
.model DLED D N=1
.ends optotof

.model D D
.lib standard.dio
.tran 0 6.1m 6m uic
.MODEL TOFSW2 SW(Ron=10m Roff=100Meg Vt=2 Vh=1)
.MODEL DTOF D(IS=10e-18 RS=16m CJO=50p N=100m)
*
.param Vin=400
*
* LLC controller parameters
*
.param DT=50n ; deadtime for the MOSFETs
.param Fswmin=120k
.param Fswmax=500k
.param VDRV=12
.param Rpullup=20k
*
.options abstol=1u vntol=1m reltol=0.01 gmin=100p
+method=gear
*
.param Gfc=-1 ; magnitude at crossover
.param PS=-80 ; phase lag at crossover
*
*
* Enter Design Goals Information Here *
*
.param fc=2k ; targeted crossover
.param PM=70 ; choose phase margin at crossover
*
* Pole-zero calculations *
*
.param boost=PM-PS-90
.param fp={(tan(boost*pi/180)+sqrt((tan(boost*pi/180))**2+1))*fc}
.param fz={fc**2/fp}
*
* Enter the Values for Vout and Bridge Bias Current *
*
.param Vout=24
.param Ibias=2m
.param Vref=2.5
.param Rlower={Vref/Ibias}
.param Rupper={(Vout-Vref)/Ibias}
*
* Optocoupler specifications *
*
.param Fopto=15k
.param Copto={1/(2*pi*Fopto*Rpullup)}
.param CTR=0.85
*
.param VL=2.5
.param VCEsat=0.3
.param Vdd=5 ; internal pullup voltage in the IC
.param Ib=1m ; bias current for the TL431
.param Vf=1
.param A={Vout-Vf-VL}
.param B={Vdd-VCEsat+Ib*CTR*Rpullup}
.param Rmax={(A/B)*Rpullup*CTR}
*
* Do not edit the below lines *
*
.param G={10**(-Gfc/20)}
.param RLED={CTR*Rpullup/G}
.param C1={1/(2*pi*fz*Rupper)}
.param C2={1/(2*pi*fp*Rpullup)}
.param Ccol={C2-Copto}
*
*
.backanno
.end